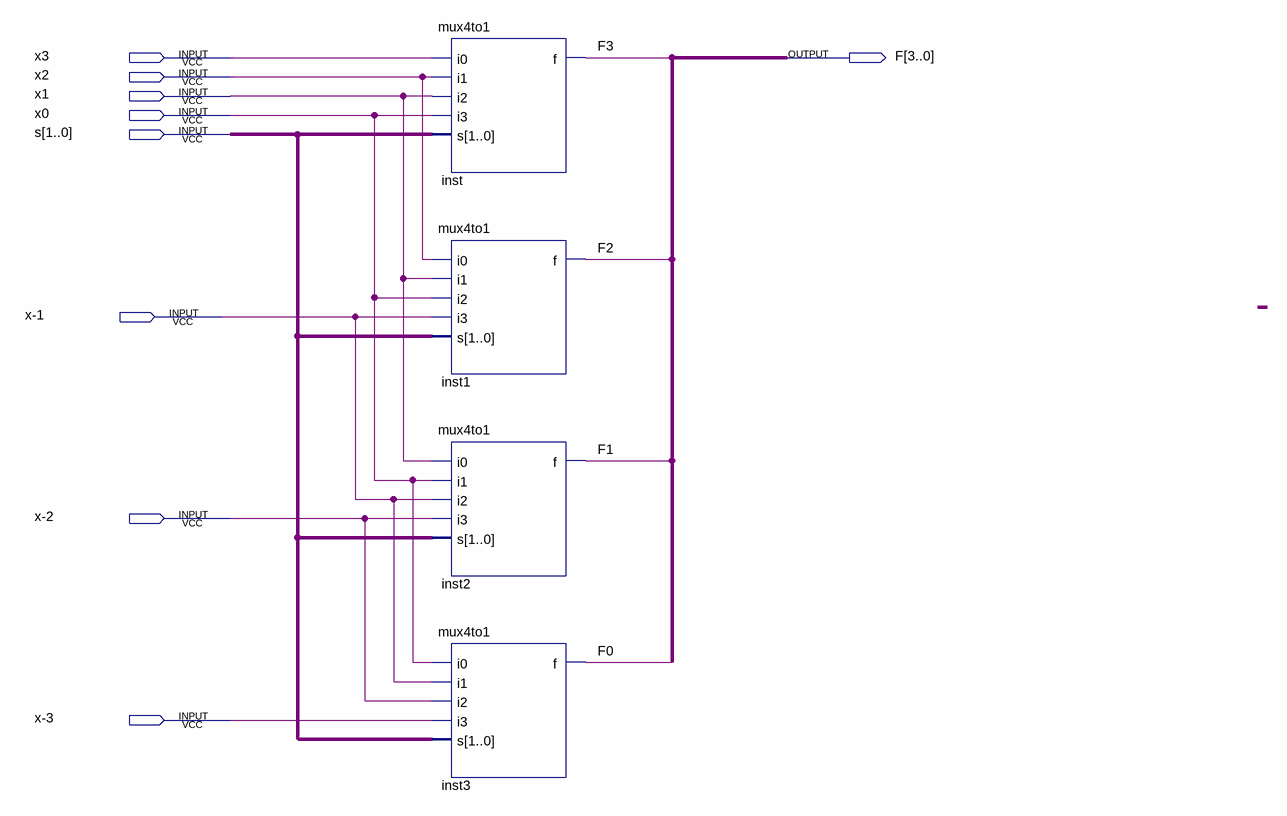
[diagram p0: schematic sheet]
// Quartus schematic lab8step2.bdf as structural Verilog: 4 symbols, 9 pins
module lab8step2 (
  input  x3,
  input  x2,
  input  x1,
  input  x0,
  input  [1:0] s,
  input  \x-1 ,
  input  \x-2 ,
  input  \x-3 ,
  output [3:0] F
);

  mux4to1 inst (.i0(x3), .i1(x2), .i2(x1), .i3(x0), .s(s), .f(F[3]));
  mux4to1 inst1 (.i0(x2), .i1(x1), .i2(x0), .i3(\x-1 ), .s(s), .f(F[2]));
  mux4to1 inst2 (.i0(x1), .i1(x0), .i2(\x-1 ), .i3(\x-2 ), .s(s), .f(F[1]));
  mux4to1 inst3 (.i0(x0), .i1(\x-1 ), .i2(\x-2 ), .i3(\x-3 ), .s(s), .f(F[0]));
endmodule
